# EAGLE design ArqSAME70Comp (EAGLE 9.2.2)
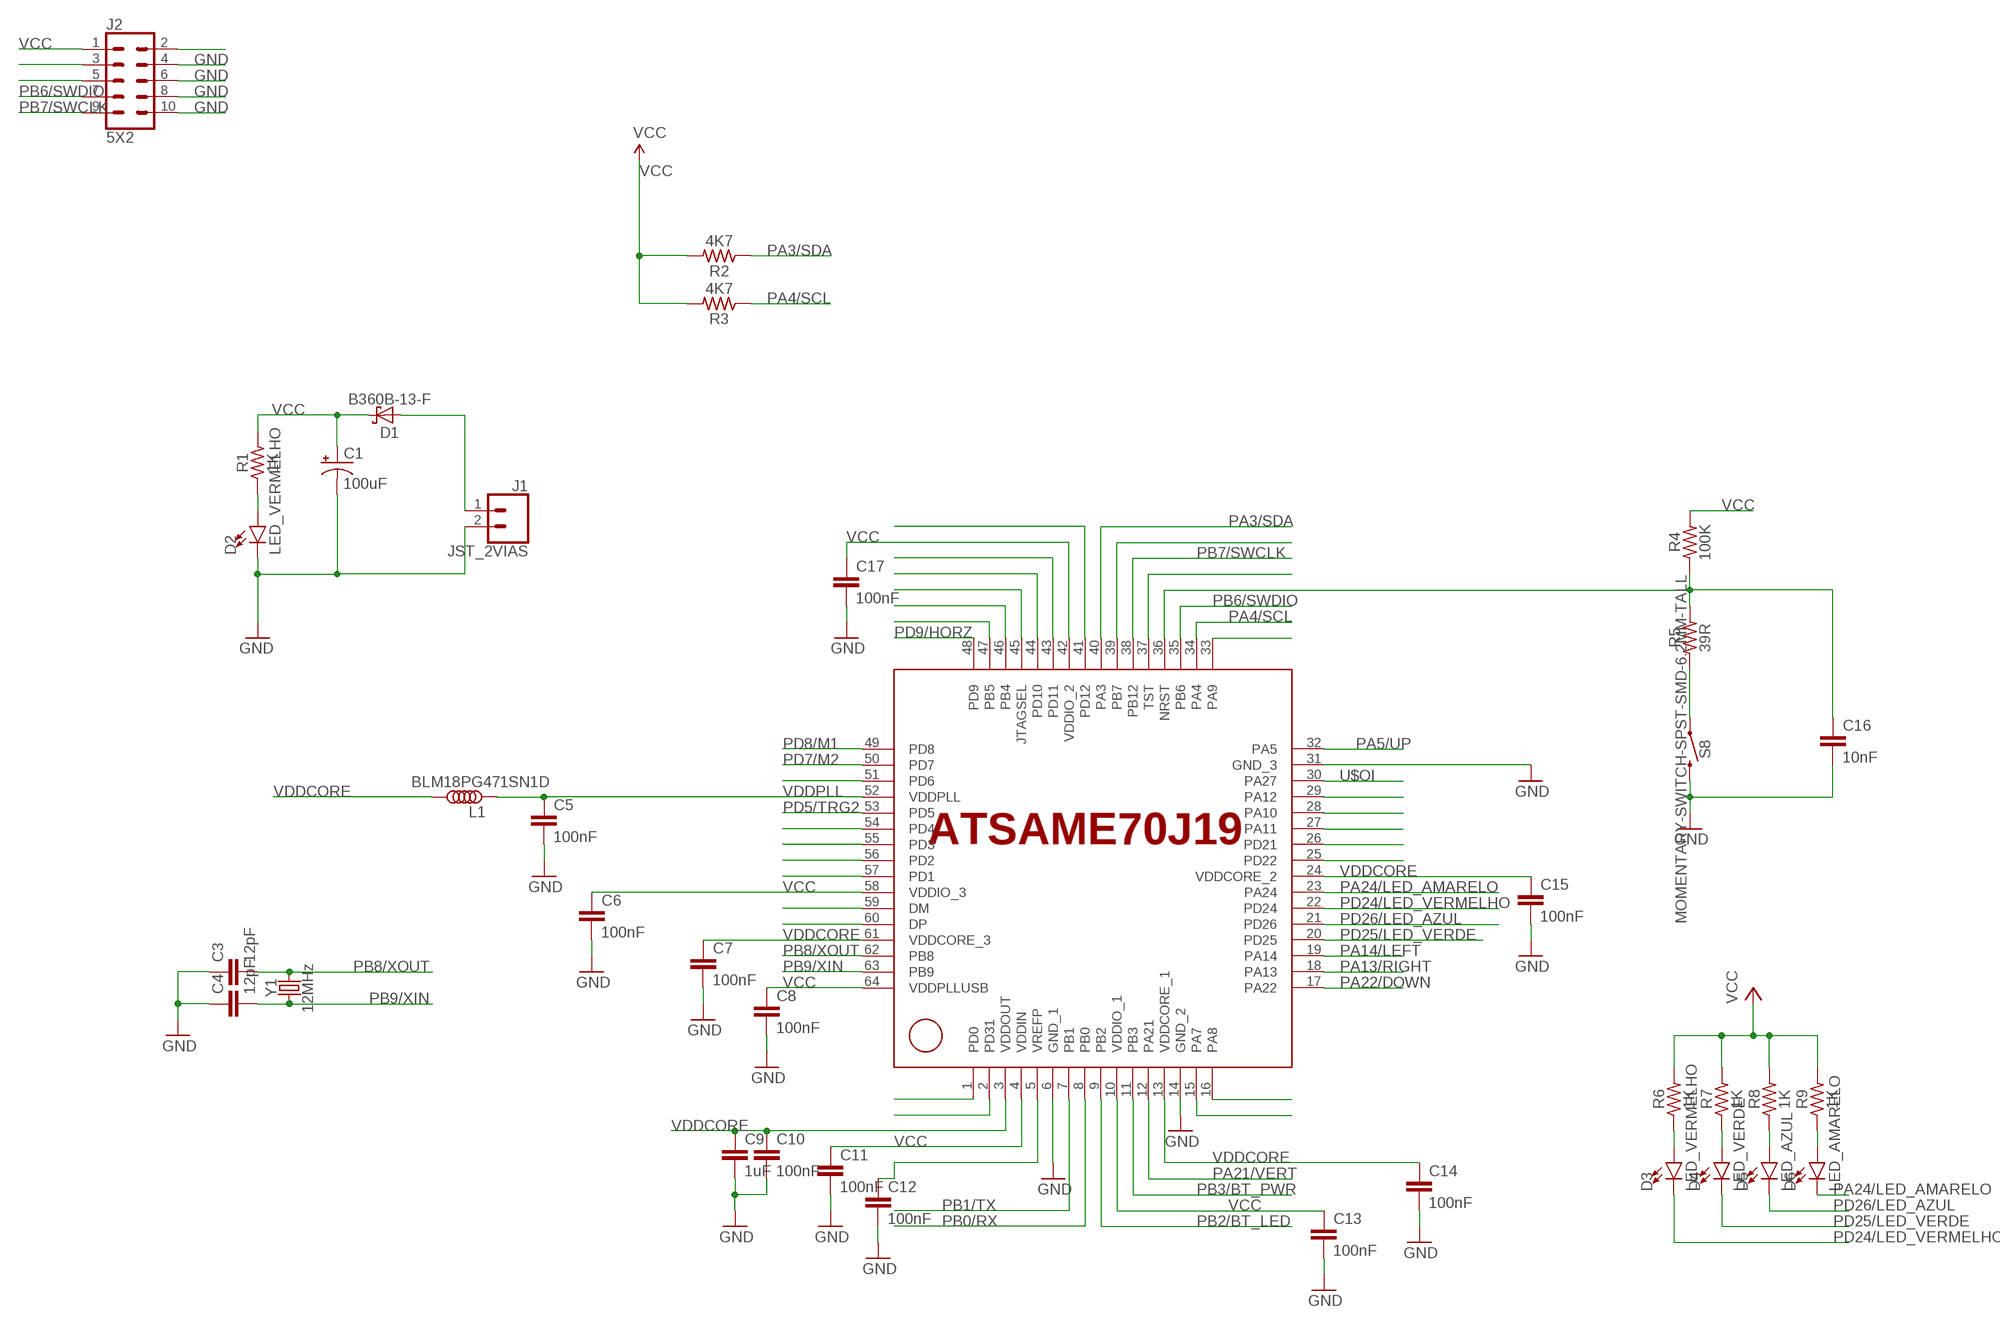
[diagram p0: schematic, sheet 1]

## Parts
C1  100uF  CAP_POLD  [PANASONIC_D]
C3  12pF  12PF-0603-50V-5%  [0603]
C4  12pF  12PF-0603-50V-5%  [0603]
C5  100nF  C-EUC0603K  [C0603K]
C6  100nF  C-EUC0603K  [C0603K]
C7  100nF  C-EUC0603K  [C0603K]
C8  100nF  C-EUC0603K  [C0603K]
C9  1uF  C-EUC0603K  [C0603K]
C10  100nF  C-EUC0603K  [C0603K]
C11  100nF  C-EUC0603K  [C0603K]
C12  100nF  C-EUC0603K  [C0603K]
C13  100nF  C-EUC0603K  [C0603K]
C14  100nF  C-EUC0603K  [C0603K]
C15  100nF  C-EUC0603K  [C0603K]
C16  10nF  C-EUC0603K  [C0603K]
C17  100nF  C-EUC0603K  [C0603K]
D1  B360B-13-F  SCHOTTKY-DIODE  [DIODE_SMB]
D2  LED_VERMELHO  LED1206  [LED-1206]
D3  LED_VERMELHO  LED1206  [LED-1206]
D4  LED_VERDE  LED1206  [LED-1206]
D5  LED_AZUL  LED1206  [LED-1206]
D6  LED_AMARELO  LED1206  [LED-1206]
J1  JST_2VIAS  CONN_02-JST-2MM-SMT  [JST-2-SMD]
J2  5X2  CONN_5X2  [2X5]
L1  BLM18PG471SN1D  FERRITE_0603  [PACKAGE_0603]
R1  1K  R-US_R0603  [R0603]
R2  4K7  R-US_R0603  [R0603]
R3  4K7  R-US_R0603  [R0603]
R4  100K  R-US_R0603  [R0603]
R5  39R  R-US_R0603  [R0603]
R6  1K  R-US_R0603  [R0603]
R7  1K  R-US_R0603  [R0603]
R8  1K  R-US_R0603  [R0603]
R9  1K  R-US_R0603  [R0603]
S8  MOMENTARY-SWITCH-SPST-SMD-6.2MM-TALL  [TACTILE_SWITCH_SMD_6.2MM_TALL]
UC  ATSAME70J19_LQFP64  ATSAME70J19LQFP64  [LQFP64]
Y1  12MHz  CRYSTAL-12MHZ"  [CRYSTAL-SMD-5X3.2-4PAD]

## Nets
GND: C1.- C3.1 C4.1 C5.2 C6.2 C7.2 C8.2 C9.2 C10.2 C11.2 C12.2 C13.2 C14.2 C15.2 C16.2 C17.2 D2.C J1.2 J2.4 J2.6 J2.8 J2.10 S8.B2 UC.6(GND_1) UC.14(GND_2) UC.31(GND_3)
N$1: D1.A(C) J1.1
N$2: D2.A R1.1
N$3: UC.16(PA8)
N$4: UC.15(PA7)
N$7: R5.1 S8.A2
N$8: J2.2
N$11: UC.43(PD11)
N$13: UC.1(PD0)
N$14: UC.2(PD31)
N$15: C12.1 UC.5(VREFP)
N$18: D3.A R6.1
N$19: J2.3
N$20: J2.5
N$21: D4.A R7.1
N$22: UC.29(PA12)
N$23: UC.28(PA10)
N$24: UC.27(PA11)
N$25: UC.26(PD21)
N$26: UC.25(PD22)
N$27: D5.A R8.1
N$28: D6.A R9.1
N$35: UC.33(PA9)
N$38: C16.1 R4.1 R5.2 UC.36(NRST)
N$39: UC.37(TST)
N$40: UC.38(PB12)
N$44: UC.47(PB5)
N$45: UC.46(PB4)
N$46: UC.45(JTAGSEL)
N$47: UC.44(PD10)
N$50: UC.41(PD12)
N$53: UC.51(PD6)
N$56: UC.54(PD4)
N$57: UC.55(PD3)
N$58: UC.56(PD2)
N$59: UC.57(PD1)
N$61: UC.59(DM)
N$62: UC.60(DP)
PA3/SDA: R2.1 UC.40(PA3)
PA4/SCL: R3.1 UC.34(PA4)
PA5/UP: UC.32(PA5)
PA13/RIGHT: UC.18(PA13)
PA14/LEFT: UC.19(PA14)
PA21/VERT: UC.12(PA21)
PA22/DOWN: UC.17(PA22)
PA24/LED_AMARELO: D6.C UC.23(PA24)
PB0/RX: UC.8(PB0)
PB1/TX: UC.7(PB1)
PB2/BT_LED: UC.9(PB2)
PB3/BT_PWR: UC.11(PB3)
PB6/SWDIO: J2.7 UC.35(PB6)
PB7/SWCLK: J2.9 UC.39(PB7)
PB8/XOUT: C3.2 UC.62(PB8) Y1.3
PB9/XIN: C4.2 UC.63(PB9) Y1.1
PD5/TRG2: UC.53(PD5)
PD7/M2: UC.50(PD7)
PD8/M1: UC.49(PD8)
PD9/HORZ: UC.48(PD9)
PD24/LED_VERMELHO: D3.C UC.22(PD24)
PD25/LED_VERDE: D4.C UC.20(PD25)
PD26/LED_AZUL: D5.C UC.21(PD26)
U$OI: UC.30(PA27)
VCC: C1.+ C6.1 C8.1 C11.1 C13.1 C17.1 D1.C(A) J2.1 R1.2 R2.2 R3.2 R4.2 R6.2 R7.2 R8.2 R9.2 UC.4(VDDIN) UC.10(VDDIO_1) UC.42(VDDIO_2) UC.58(VDDIO_3) UC.64(VDDPLLUSB)
VDDCORE: C7.1 C9.1 C10.1 C14.1 C15.1 L1.2 UC.3(VDDOUT) UC.13(VDDCORE_1) UC.24(VDDCORE_2) UC.61(VDDCORE_3)
VDDPLL: C5.1 L1.1 UC.52(VDDPLL)

## Library data of the parts
C1 = SparkFun-Capacitors:CAP_POL: Capacitor Polarized These are standard SMD and PTH capacitors. Normally 10uF, 47uF, and 100uF in electrolytic and tantalum varieties. Always verify the external diameter of the through hole cap, it varies with capacity, voltage, and manufacturer. The EIA devices should be standard.
C3 C4 = SparkFun-Capacitors:12PF: 12pF ceramic capacitors A capacitor is a passive two-terminal electrical component used to store electrical energy temporarily in an electric field.; PROD_ID: CAP-09137
C5-C17 = rcl:C-EU: CAPACITOR, European symbol; SPICEPREFIX: C
D1 = eagle-ltspice:SCHOTTKY-DIODE: Schottky Diode; SPICEMODEL: NONE; SPICEPREFIX: D; SPICETYPE: diode
D2-D6 = SparkFun-LED:LED: LED (Generic) Standard schematic elements and footprints for 5mm, 3mm, 1206, and 0603 sized LEDs. Generic LEDs with no color specified.
J1 = SparkFun-Connectors:CONN_02: Multi connection point. Often used as Generic Header-pin footprint for 0.1 inch spaced/style header connections On any of the 0.1 inch spaced packages, you can populate with these: Break Away Headers - Straight <https://www.sparkfun.com/products/116> (PRT-00116) Break Away Male Headers - Right Angle <https://www.sparkfun.com/products/553> (PRT-00553) Female Headers <https://www.sparkfun.com/products/115> (PRT-00115) Break Away Headers - Machine Pin <https://www.sparkfun.com/products/117> (PRT-00117) Break Away Female Headers - Swiss Machine Pin <https://www.sparkfun.com/products/743> (PRT-00743) For SCREWTERMINALS and SPRING TERMINALS visit here: Screw Terimnals on SparkFun.com <https://www.sparkfun.com/search/results?term=Screw+Terminals> (5mm/3.5mm/2.54mm spacing) This device is also useful as a general connection point to wire up your design to another part of your project. Our various solder wires solder well into these plated through hole pads. Hook-Up Wire - Assortment (Stranded, 22 AWG) <https://www.sparkfun.com/products/11375> (PRT-11375) Hook-Up Wire - Assortment (Solid Core, 22 AWG) <https://www.sparkfun.com/products/11367> (PRT-11367) View the entire wire category on our website here <https://www.sparkfun.com/categories/141> Special notes: Molex polarized connector foot print use with: PRT-08233 with associated crimp pins and housings. 2.54_SCREWTERM for use with PRT-10571. 3.5mm Screw Terminal footprints for PRT-08084 5mm Screw Terminal footprints for use with PRT-08432; PROD_ID: CONN-11443
J2 = M3LLOD:CONN_5X2
L1 = M3LLOD:FERRITE_0603
R1-R9 = rcl:R-US_: RESISTOR, American symbol; SPICEPREFIX: R
S8 = SparkFun-Switches:MOMENTARY-SWITCH-SPST: Momentary Switch (Pushbutton) - SPST Normally-open (NO) SPST momentary switches (buttons, pushbuttons). Variants PTH-12MM - 12mm square, through-hole Momentary Pushbutton Switch - 12mm Square <https://www.sparkfun.com/products/9190> (COM-09190) PTH-6.0MM, PTH-6.0MM-KIT - 6.0mm square, through-hole Mini Pushbutton Switch <https://www.sparkfun.com/products/97> (COM-00097) KIT package intended for soldering kit's - only one side of pads' copper is exposed. PTH-RIGHT-ANGLE-KIT - Right-angle, through-hole Right Angle Tactile Button <https://www.sparkfun.com/products/10791> - Used on SparkFun BigTime Watch Kit <https://www.sparkfun.com/products/11734> SMD-12MM - 12mm square, surface-mount Tactile Button - SMD (12mm) <https://www.sparkfun.com/products/12993> (COM-12993) Used on SparkFun PicoBoard <https://www.sparkfun.com/products/11888> SMD-4.5MM - 4.5mm Square Trackball Switch Used on SparkFun Blackberry Trackballer Breakout <https://www.sparkfun.com/products/13169> SMD-4.6MMX2.8MM - 4.60mm x 2.80mm, surface mount Used on SparkFun SAMD21 Mini Breakout <https://www.sparkfun.com/products/13664> SMD-5.2MM, SMD-5.2-REDUNDANT - 5.2mm square, surface-mount Mini Pushbutton Switch - SMD <https://www.sparkfun.com/products/8720> (COM-08720) Used on Arduino Pro Mini <https://www.sparkfun.com/products/11114> REDUNDANT package connects both switch circuits together SMD-6.0X3.5MM - 6.0 x 3.5mm, surface mount Momentary Reset Switch SMD <https://www.sparkfun.com/products/8229> (COM-08229) SMD-6.2MM-TALL - 6.2mm square, surface mount Tactile Button - SMD (6mm) <https://www.sparkfun.com/products/12992> Used on SparkFun Digital Sandbox <https://www.sparkfun.com/products/12651> SMD-RIGHT-ANGLE - Right-angle, surface mount Used on SparkFun Block for Intel® Edison - Arduino <https://www.sparkfun.com/products/13036>; PROD_ID: SWCH-11966; SF_SKU: COM-12992
UC = M3LLOD:ATSAME70J19: UPS051 The UPS051 is a digital interface IC for Unipac's small TFT COG LCD panels. It accepts sync and digital data one subpixel at a time and outputs the appropriate analog voltages and timing signals to the LCD.
Y1 = SparkFun-Clocks:CRYSTAL-12MHZ: 12.0MHz Crystal Frequency: 12.0MHz Frequency Tolerance: ±20ppm Load Capacitance: 18pF SparkFun Products: SparkFun Logomatic <https://www.sparkfun.com/products/12772> Pocket AVR Programmer <https://www.sparkfun.com/products/9825>; PROD_ID: XTAL-08297

## Net classes
0 default: width 0.305 mm

## Board
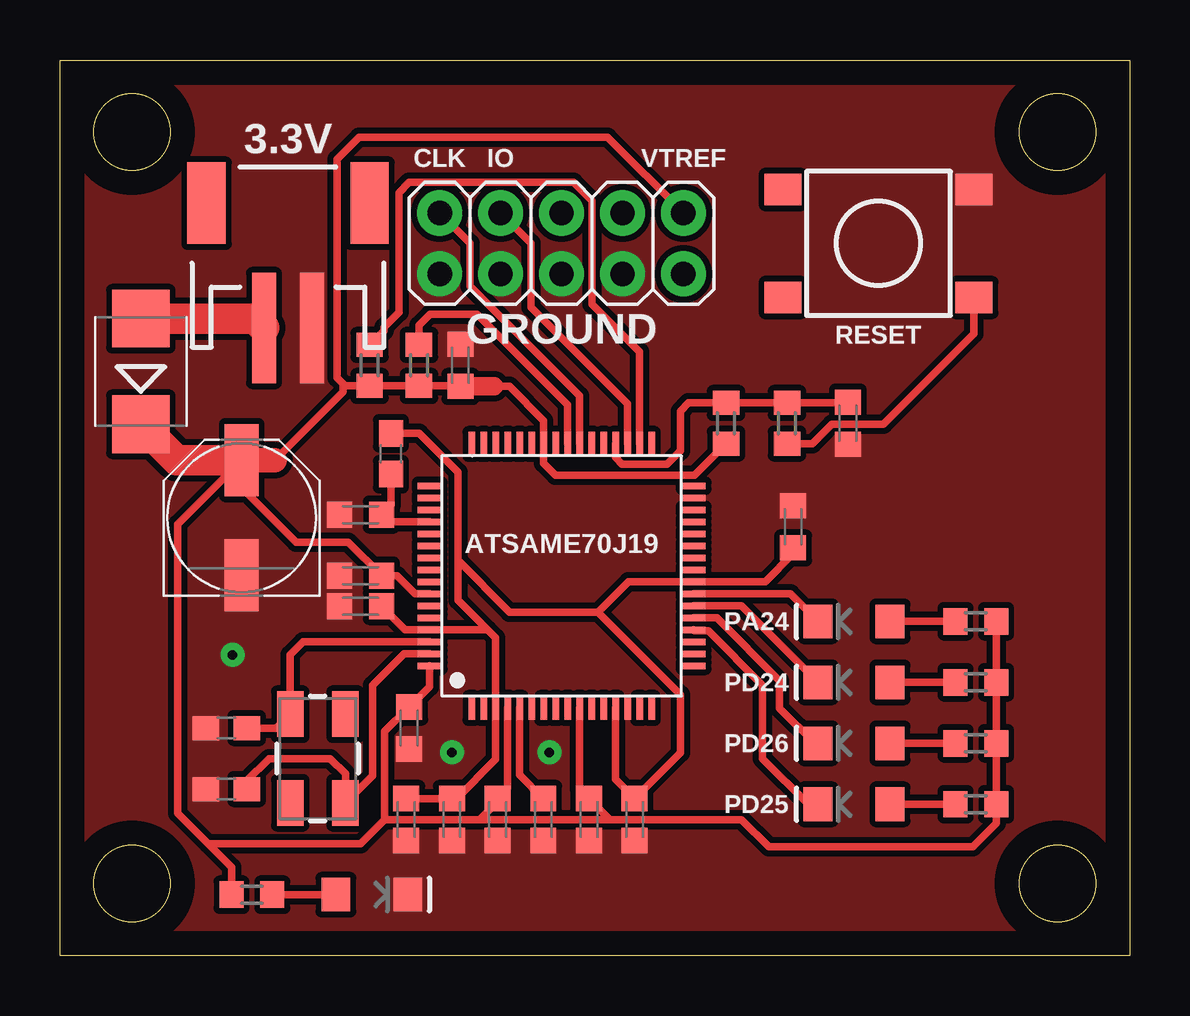
[diagram p1: board, top side]
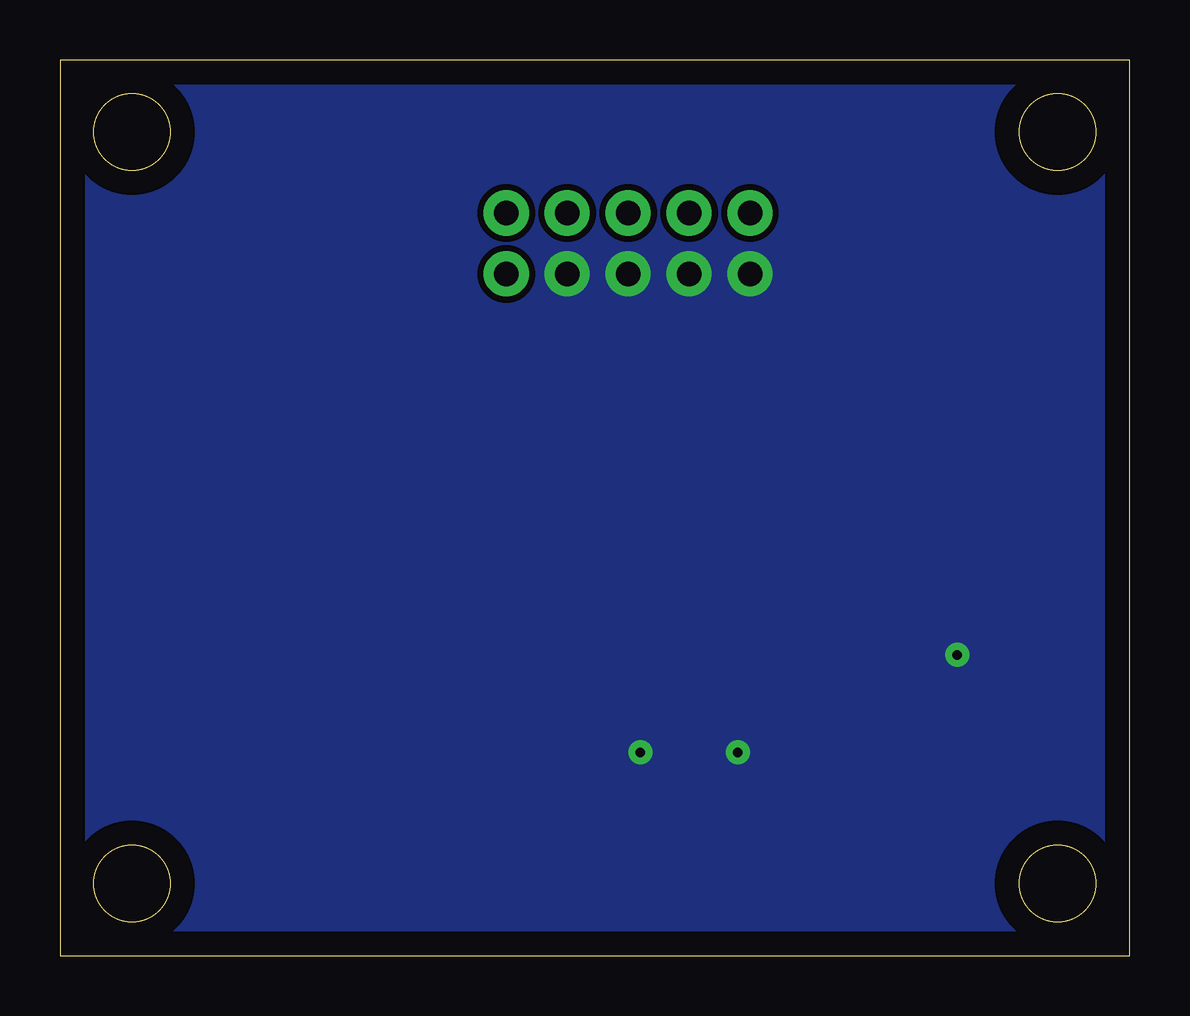
[diagram p2: board, bottom side, seen from below]

Size 44.59 x 37.31 mm. Coordinates in mm from the lower left corner, seen from the top.
Outline: 0,37.31 44.59,37.31 44.59,0 0,0 0,37.31
Outline: circle at 3,3 radius 1.6
Outline: circle at 41.59,3 radius 1.6
Outline: circle at 41.59,34.31 radius 1.6
Outline: circle at 3,34.31 radius 1.6
Copper layers (1*16): Top 0.035mm / dielectric 1.5mm / Bottom 0.035mm
Design rules "default *": minimum track width 6mil, minimum drill 0.35mm, track to track 6mil, track to pad 6mil, pad to pad 6mil, via to via 6mil, smd to smd 6mil, copper to edge 40mil, drill to drill 6mil, minimum pad ring 10mil, minimum via ring 8mil, stop-mask expansion 4mil, vias tented up to drill 0mil, thermal gap 10mil

### Footprints (pad centres in the part's own frame; a part is rotated, then mirrored left to right if it is on the bottom)
PANASONIC_D = smd 3 x 1.4: + 2.4,0; - -2.4,0
0603 = smd 1.1 x 1: 1 -0.85,0; 2 0.85,0
C0603K = smd 1.05 x 1.08: 1 -0.875,0; 2 0.875,0
DIODE_SMB = smd 2.4 x 2.4: A 2.2,0; C -2.2,0
LED-1206 = smd 1.2 x 1.4: A -1.5,0; C 1.5,0
JST-2-SMD = smd 1 x 4.6: 1 -1,-3.7; 2 1,-3.7 | smd 1.6 x 3.4: NC1 -3.4,1.5; NC2 3.4,1.5
2X5 = drill 1.016 pad 1.88: 1 0,0; 2 0,2.54; 3 2.54,0; 4 2.54,2.54; 5 5.08,0; 6 5.08,2.54; 7 7.62,0; 8 7.62,2.54; 9 10.16,0; 10 10.16,2.54
PACKAGE_0603 = smd 1.1 x 1: 1 -0.85,0; 2 0.85,0
R0603 = smd 1 x 1.1: 1 -0.85,0; 2 0.85,0
TACTILE_SWITCH_SMD_6.2MM_TALL = smd 1.55 x 1.3: A1 -3.975,-2.25; A2 3.975,-2.25; B1 -3.975,2.25; B2 3.975,2.25
LQFP64 = smd 0.27 x 1: 1 -3.75,-5.51; 2 -3.25,-5.51; 3 -2.75,-5.51; 4 -2.25,-5.51; 5 -1.75,-5.51; 6 -1.25,-5.51; 7 -0.75,-5.51; 8 -0.25,-5.51; 9 0.25,-5.51; 10 0.75,-5.51; 11 1.25,-5.51; 12 1.75,-5.51; 13 2.25,-5.51; 14 2.75,-5.51; 15 3.25,-5.51; 16 3.75,-5.51; 33 3.75,5.49; 34 3.25,5.49; 35 2.75,5.49; 36 2.25,5.49; 37 1.75,5.49; 38 1.25,5.49; 39 0.75,5.49; 40 0.25,5.49; 41 -0.25,5.49; 42 -0.75,5.49; 43 -1.25,5.49; 44 -1.75,5.49; 45 -2.25,5.49; 46 -2.75,5.49; 47 -3.25,5.49; 48 -3.75,5.49 | smd 1 x 0.27: 17 5.5,-3.76; 18 5.5,-3.26; 19 5.5,-2.76; 20 5.5,-2.26; 21 5.5,-1.76; 22 5.5,-1.26; 23 5.5,-0.76; 24 5.5,-0.26; 25 5.5,0.24; 26 5.5,0.74; 27 5.5,1.24; 28 5.5,1.74; 29 5.5,2.24; 30 5.5,2.74; 31 5.5,3.24; 32 5.5,3.74; 49 -5.5,3.74; 50 -5.5,3.24; 51 -5.5,2.74; 52 -5.5,2.24; 53 -5.5,1.74; 54 -5.5,1.24; 55 -5.5,0.74; 56 -5.5,0.24; 57 -5.5,-0.26; 58 -5.5,-0.76; 59 -5.5,-1.26; 60 -5.5,-1.76; 61 -5.5,-2.26; 62 -5.5,-2.76; 63 -5.5,-3.26; 64 -5.5,-3.76
CRYSTAL-SMD-5X3.2-4PAD = smd 1.9 x 1.1: 1 -1.85,-1.15; 2 1.85,-1.15; 3 1.85,1.15; 4 -1.85,1.15

### Placement (x,y rotation side)
C1  7.57,18.24 90 top
C3  6.94,9.48 0 top
C4  6.94,6.94 0 top
C5  12.53,18.37 180 top
C6  12.53,15.83 180 top
C7  12.53,14.56 180 top
C8  14.56,9.48 270 top
C9  16.34,5.67 270 top
C10  14.43,5.67 270 top
C11  18.24,5.67 270 top
C12  20.14,5.67 270 top
C13  22.05,5.67 270 top
C14  23.95,5.67 270 top
C15  30.56,17.86 90 top
C16  32.84,22.18 270 top
C17  16.69,24.59 90 top
D1  3.37,24.34 90 top
D2  13,2.54 0 top
D3  33.1,11.38 180 top
D4  33.1,6.3 180 top
D5  33.1,8.84 180 top
D6  33.1,13.92 180 top
J1  9.51,29.85 0 top
J2  25.99,30.94 180 top
L1  13.79,20.91 90 top
R1  8,2.54 180 top
R2  14.96,24.59 270 top
R3  12.91,24.59 270 top
R4  27.77,22.18 270 top
R5  30.3,22.18 90 top
R6  38.18,11.38 0 top
R7  38.18,6.3 0 top
R8  38.18,8.84 0 top
R9  38.18,13.92 0 top
S8  34.12,29.67 0 top
UC  20.91,15.83 0 top
Y1  10.75,8.21 90 top

### Tracks (layer width: path | path; a pad name or v marks a point on that pad's centre or on a via)
GND  (via drill 0.4 pad 1)
  other vias: 16.34,8.46 7.19,12.53 20.4,8.46
  pour Bottom (isolate 0.254, no thermals): 0,0 44.59,0 44.59,37.31 0,37.31
  pour Top (isolate 0.254, no thermals): 0,0 44.59,0 44.59,37.31 0,37.31
N$1
  Top 1.27: J1.1 8.12,26.54 D1.A
N$2
  Top 0.305: R1.1 D2.A
N$7
  Top 0.305: R5.1 31.37,21.33 32.18,22.13 34.32,22.13 38.09,25.9 S8.A2
N$15
  Top 0.305: C12.1 19.16,7.53 UC.5
N$18
  Top 0.305: R6.1 D3.A
N$21
  Top 0.305: R7.1 D4.A
N$27
  Top 0.305: R8.1 D5.A
N$28
  Top 0.305: D6.A R9.1
N$38
  Top 0.305: UC.36 23.16,20.75 23.43,20.48 25.3,20.48 25.86,21.03 25.86,22.68 26.2,23.03 R4.1 R5.2 32.82,23.03 C16.1
PA3/SDA
  Top 0.305: UC.40 21.16,22.94 17.38,26.72 15.42,26.72 14.96,26.27 R2.1
PA4/SCL
  Top 0.305: UC.34 24.16,25.15 22.18,27.13 22.18,31.45 21.41,32.21 14.56,32.21 14.13,31.79 14.13,26.81 13.5,26.18 13.5,26.04 R3.1
PA24/LED_AMARELO
  Top 0.305: UC.23 30.45,15.07 D6.C
PB6/SWDIO
  Top 0.305: J2.7 19.64,29.67 19.64,27 23.66,22.98 UC.35
PB7/SWCLK
  Top 0.305: UC.39 21.66,23.33 17.1,27.89 17.1,29.67 J2.9
PB8/XOUT
  Top 0.305: UC.62 10.14,13.07 9.6,12.53 Y1.3 9.02,9.48 C3.2
PB9/XIN
  Top 0.305: UC.63 14.35,12.57 13.03,11.26 13.03,7.49 Y1.1 11.9,7.57 11.26,8.21 8.71,8.21 7.79,7.28 C4.2
PD24/LED_VERMELHO
  Top 0.305: D3.C 28.41,14.57 UC.22
PD25/LED_VERDE
  Top 0.305: UC.20 26.45,13.52 27.03,13.52 29.29,11.27 29.29,8.21 31.19,6.3 D4.C
PD26/LED_AZUL
  Top 0.305: UC.21 27.38,14.07 30,11.46 30,10.31 31.46,8.84 D5.C
VCC
  Top 0.305: UC.64 15.41,11.2 C8.1 13.54,9.34 13.54,5.67 | R9.2 R6.2 R8.2 R7.2 39.03,5.5 38.05,4.52 29.54,4.52 28.4,5.67 22.93,5.67 | UC.58 14.81,15.06 14.05,15.83 C6.1 12.02,17.22 9.85,17.22 7.57,19.5 C1.+ 4.91,17.97 4.91,5.92 6.17,4.65 | J2.1 22.83,34.1 12.47,34.1 11.55,33.18 11.55,24.08 11.8,23.83 | 6.17,4.65 12.53,4.65 13.54,5.67 | 13.54,5.67 17.49,5.67 | 22.93,5.67 C13.1 21.66,6.93 UC.10 | 17.49,5.67 18.24,6.42 C11.1 18.66,6.96 UC.4 | 18.1,23.71 18.73,23.71 20.16,22.29 UC.42 20.16,20.51 20.65,20.02 26.46,20.02 R4.2 | 17.49,5.67 22.93,5.67 | 11.8,23.83 11.8,23.49 8.96,20.64 | 11.8,23.83 11.89,23.74 R3.2 R2.2 16.67,23.74 C17.1 | R1.2 7.15,3.68 6.17,4.65
  Top 0.762: 18.1,23.71 C17.1
  Top 1.016: 8.96,20.64 C1.+
  Top 1.27: D1.C 4.87,20.64 C1.+
VDDCORE
  Top 0.305: C7.1 14.39,13.57 UC.61 17.83,13.57 | L1.2 14.98,21.76 16.59,20.14 16.59,16.46 | 16.59,16.46 16.59,14.81 17.83,13.57 | 17.83,13.57 18.16,13.24 UC.3 18.16,8.17 16.53,6.54 C9.1 C10.1 | C15.1 30.56,16.73 29.4,15.57 UC.24 23.7,15.57 22.43,14.3 | 22.43,14.3 18.75,14.3 16.59,16.46 | 22.43,14.3 25.86,10.87 25.86,8.45 C14.1 23.16,7.34 UC.13
VDDPLL
  Top 0.305: L1.1 13.79,18.76 C5.1 13.7,18.07 UC.52

### Text on the board
tPlace: 3.3V | CLK | IO | VTREF | GROUND | RESET | PA24 | PD24 | PD26 | PD25